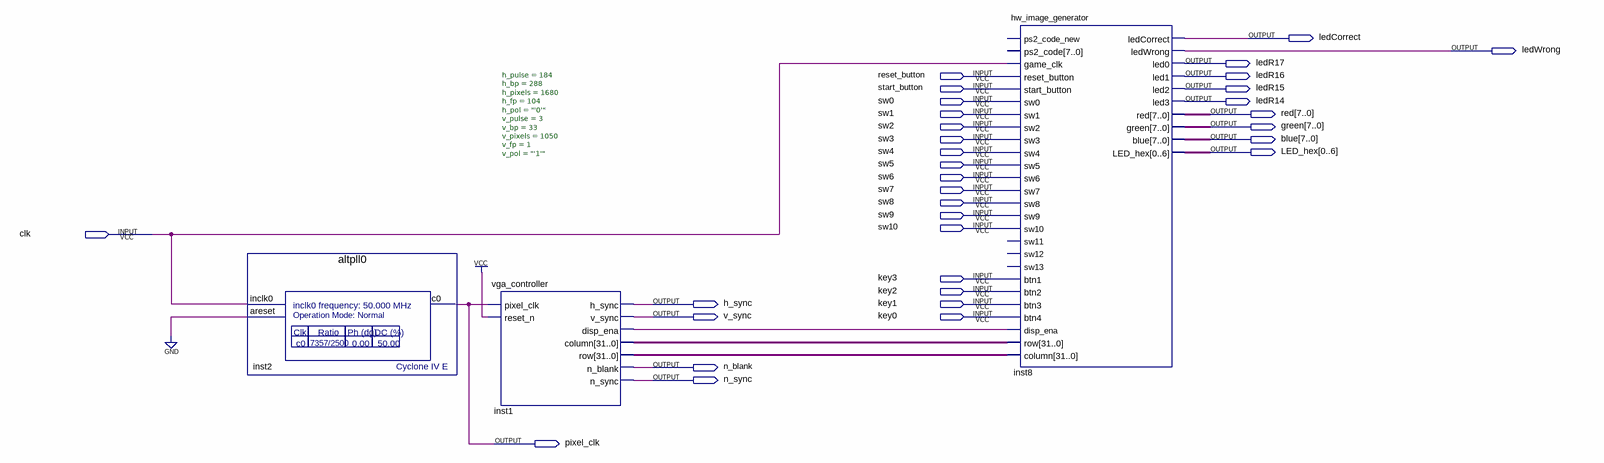
[diagram p0: schematic sheet]
// Quartus schematic vga_with_hw_test_image.bdf as structural Verilog: 3 symbols, 33 pins
module vga_with_hw_test_image (
  input  reset_button,
  input  start_button,
  input  sw0,
  input  sw1,
  input  sw2,
  input  sw3,
  input  sw4,
  input  sw5,
  input  sw6,
  input  sw7,
  input  sw8,
  input  sw9,
  input  sw10,
  input  clk,
  input  key3,
  input  key2,
  input  key1,
  input  key0,
  output ledCorrect,
  output ledWrong,
  output ledR17,
  output ledR16,
  output ledR15,
  output ledR14,
  output [7:0] red,
  output [7:0] green,
  output [7:0] blue,
  output [0:6] LED_hex,
  output h_sync,
  output v_sync,
  output n_blank,
  output n_sync,
  output pixel_clk
);

  wire inst1_disp_ena;
  wire [31:0] inst1_column, inst1_row;

  altpll0 inst2 (.inclk0(clk), .areset(1'b0), .c0(pixel_clk));
  vga_controller #(.h_pulse(184), .h_bp(288), .h_pixels(1680), .h_fp(104), .h_pol("'0'"), .v_pulse(3), .v_bp(33), .v_pixels(1050), .v_fp(1), .v_pol("'1'")) inst1 (
    .pixel_clk(pixel_clk), .reset_n(1'b1), .h_sync(h_sync), .v_sync(v_sync), .disp_ena(inst1_disp_ena),
    .column(inst1_column), .row(inst1_row), .n_blank(n_blank), .n_sync(n_sync));
  hw_image_generator inst8 (
    .game_clk(clk), .reset_button(reset_button), .start_button(start_button), .sw0(sw0), .sw1(sw1),
    .sw2(sw2), .sw3(sw3), .sw4(sw4), .sw5(sw5), .sw6(sw6), .sw7(sw7), .sw8(sw8), .sw9(sw9), .sw10(sw10),
    .btn1(key3), .btn2(key2), .btn3(key1), .btn4(key0), .disp_ena(inst1_disp_ena), .row(inst1_column),
    .column(inst1_row), .ledCorrect(ledCorrect), .ledWrong(ledWrong), .led0(ledR17), .led1(ledR16),
    .led2(ledR15), .led3(ledR14), .red(red), .green(green), .blue(blue), .LED_hex(LED_hex));  // open: ps2_code_new, ps2_code, sw11, sw12, sw13
endmodule
